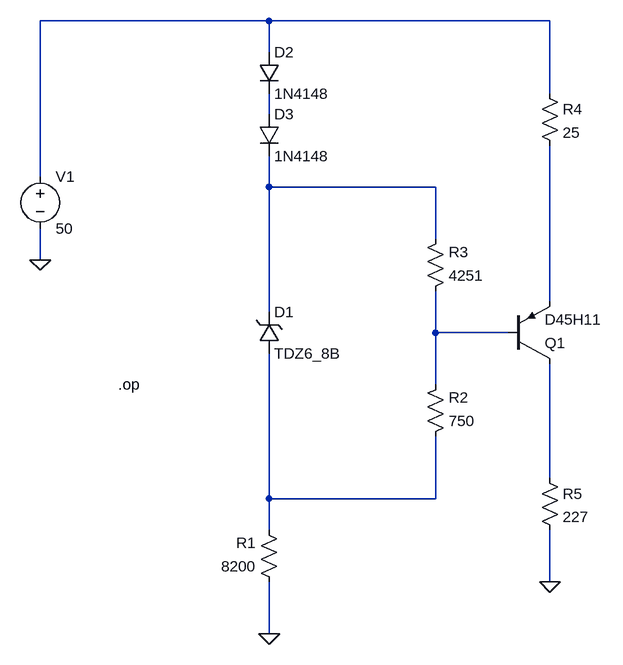
[diagram p0: schematic focusRegulator.asc]
focusRegulator.asc, the LTspice schematic file:
Version 4
SHEET 1 1172 852
WIRE 544 -112 192 -112
WIRE 976 -112 544 -112
WIRE 544 -64 544 -112
WIRE 976 0 976 -112
WIRE 544 32 544 0
WIRE 192 128 192 -112
WIRE 544 144 544 96
WIRE 800 144 544 144
WIRE 800 224 800 144
WIRE 192 256 192 208
WIRE 976 320 976 80
WIRE 544 336 544 144
WIRE 800 368 800 304
WIRE 912 368 800 368
WIRE 800 448 800 368
WIRE 976 592 976 416
WIRE 544 624 544 400
WIRE 800 624 800 528
WIRE 800 624 544 624
WIRE 544 672 544 624
WIRE 976 752 976 672
WIRE 544 832 544 752
FLAG 192 256 0
FLAG 544 832 0
FLAG 976 752 0
DATAFLAG 976 512 ""
DATAFLAG 976 208 ""
SYMBOL voltage 192 112 R0
WINDOW 123 0 0 Left 2
WINDOW 39 0 0 Left 2
SYMATTR InstName V1
SYMATTR Value 50
SYMBOL res 560 768 R180
WINDOW 0 36 76 Left 2
WINDOW 3 36 40 Left 2
SYMATTR InstName R1
SYMATTR Value 8200
SYMBOL zener 528 400 M180
WINDOW 0 24 64 Left 2
WINDOW 3 24 0 Left 2
SYMATTR InstName D1
SYMATTR Value TDZ6_8B
SYMATTR Description Diode
SYMATTR Type diode
SYMBOL diode 528 -64 R0
SYMATTR InstName D2
SYMATTR Value 1N4148
SYMBOL diode 528 32 R0
SYMATTR InstName D3
SYMATTR Value 1N4148
SYMBOL res 784 544 M180
WINDOW 0 36 76 Left 2
WINDOW 3 36 40 Left 2
SYMATTR InstName R2
SYMATTR Value 750
SYMBOL res 784 320 M180
WINDOW 0 36 76 Left 2
WINDOW 3 36 40 Left 2
SYMATTR InstName R3
SYMATTR Value 4251
SYMBOL pnp 912 416 M180
SYMATTR InstName Q1
SYMATTR Value D45H11
SYMBOL res 960 -16 R0
SYMATTR InstName R4
SYMATTR Value 25
SYMBOL res 960 576 R0
SYMATTR InstName R5
SYMATTR Value 227
TEXT 312 448 Left 2 !.op

The netlist it stands for:
* focusRegulator.asc
V1 N001 0 50
R1 0 N007 8200
D1 N007 N003 TDZ6_8B
D2 N001 N002 1N4148
D3 N002 N003 1N4148
R2 N007 N005 750
R3 N005 N003 4251
Q1 N006 N005 N004 0 D45H11
R4 N001 N004 25
R5 N006 0 227
.model D D
.lib standard.dio
.model NPN NPN
.model PNP PNP
.lib standard.bjt
.op
.backanno
.end